# Altium schematic sheet alimentacion.SchDoc
size A4
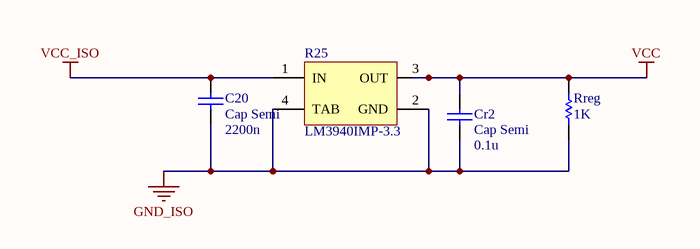
[diagram p0: alimentacion.SchDoc]

## Parts
C20  Cap Semi  value 2200n  [C1206]
Cr2  Cap Semi  value 0.1u  [1608[0603]]
R25  LM3940IMP-3.3  [MP04A_N]
Rreg  value 1K  [2012[0805]]  (hidden comment: Res Semi)

## Nets
GND_ISO: C20.1 Cr2.1 R25.2(GND) R25.4(TAB) Rreg.1
VCC: Cr2.2 R25.3(OUT) Rreg.2
VCC_ISO: C20.2 R25.1(IN)

## Library data of the parts
C20 Cr2 = Cap Semi: Capacitor (Semiconductor SIM Model); Published: 8-Jun-2000; LatestRevisionDate: 17-Jul-2002; LatestRevisionNote: Re-released for DXP Platform.; PackageReference: C1206; Publisher: Altium Limited
R25 = LM3940IMP-3.3: 1A Low Dropout Regulator for 5V to 3.3V Conversion, 4-pin SOT-223; Manufacturer: National Semiconductor; PackageTopMarking: XYTT*L52B; PowerWise: N; CompType: LDO IC; Published: 4-Dec-2008; DatasheetVersion: Jul-2007; PackageReference: MP04A; Publisher: Altium Limited; PackageDescription: Molded SOT-223, 6.50 x 3.56 x 1.6mm Body, 4 Lead, 2.3mm Pitch; ComponentLink1Description: LM3940 Datasheet; ComponentLink1URL: http://www.national.com/ds/LM/LM3940.pdf; ComponentLink2Description: LM3940 Web Page; ComponentLink2URL: http://www.national.com/pf/LM/LM3940.html; ComponentLink3Description: MP04A Package Page; ComponentLink3URL: http://www.national.com/packaging/folders/mp04a.html; PackageVersion: revB, Apr-2003; Supplier 1: Farnell; Supplier Part Number 1: 9779280; PartNumber: LM3940IMP-3.3; RoHS: N; PinCount: 4; Code_JEDEC: TO-261-AA; Code_IPC: SOT223-4
Rreg = Res Semi: Semiconductor Resistor; Published: 8-Jun-2000; LatestRevisionDate: 17-Jul-2002; LatestRevisionNote: Re-released for DXP Platform.; PackageReference: AXIAL-0.5; Publisher: Altium Limited